# Altium schematic sheet RADC-Power-S05-V00.SchDoc: RADC POWER (12V & USB, 12V Protection, 3V3 Out)
size A3; DrawnBy: Jonn Dillon; DocumentNumber: 6; SheetNumber: 6; SheetTotal: 8; Version: 00; Project: QUTMS RADIO COMPUTE; PageSetup: Record=PageOptions|CenterHorizontal=True|CenterVertical=True|PrintScale=0.97|XCorrection=1.00|YCorrection=1.00|PrintKind=0|BorderSize=5000000|LeftOffset=0|BottomOffset=0|Orientation=2|PaperLength=1000|PaperWidth=1000|Scale=100|PaperSource=7|PrintQuality=-4|MediaType=1|DitherType=10|PaperKind=A4|PrintScaleMode=1
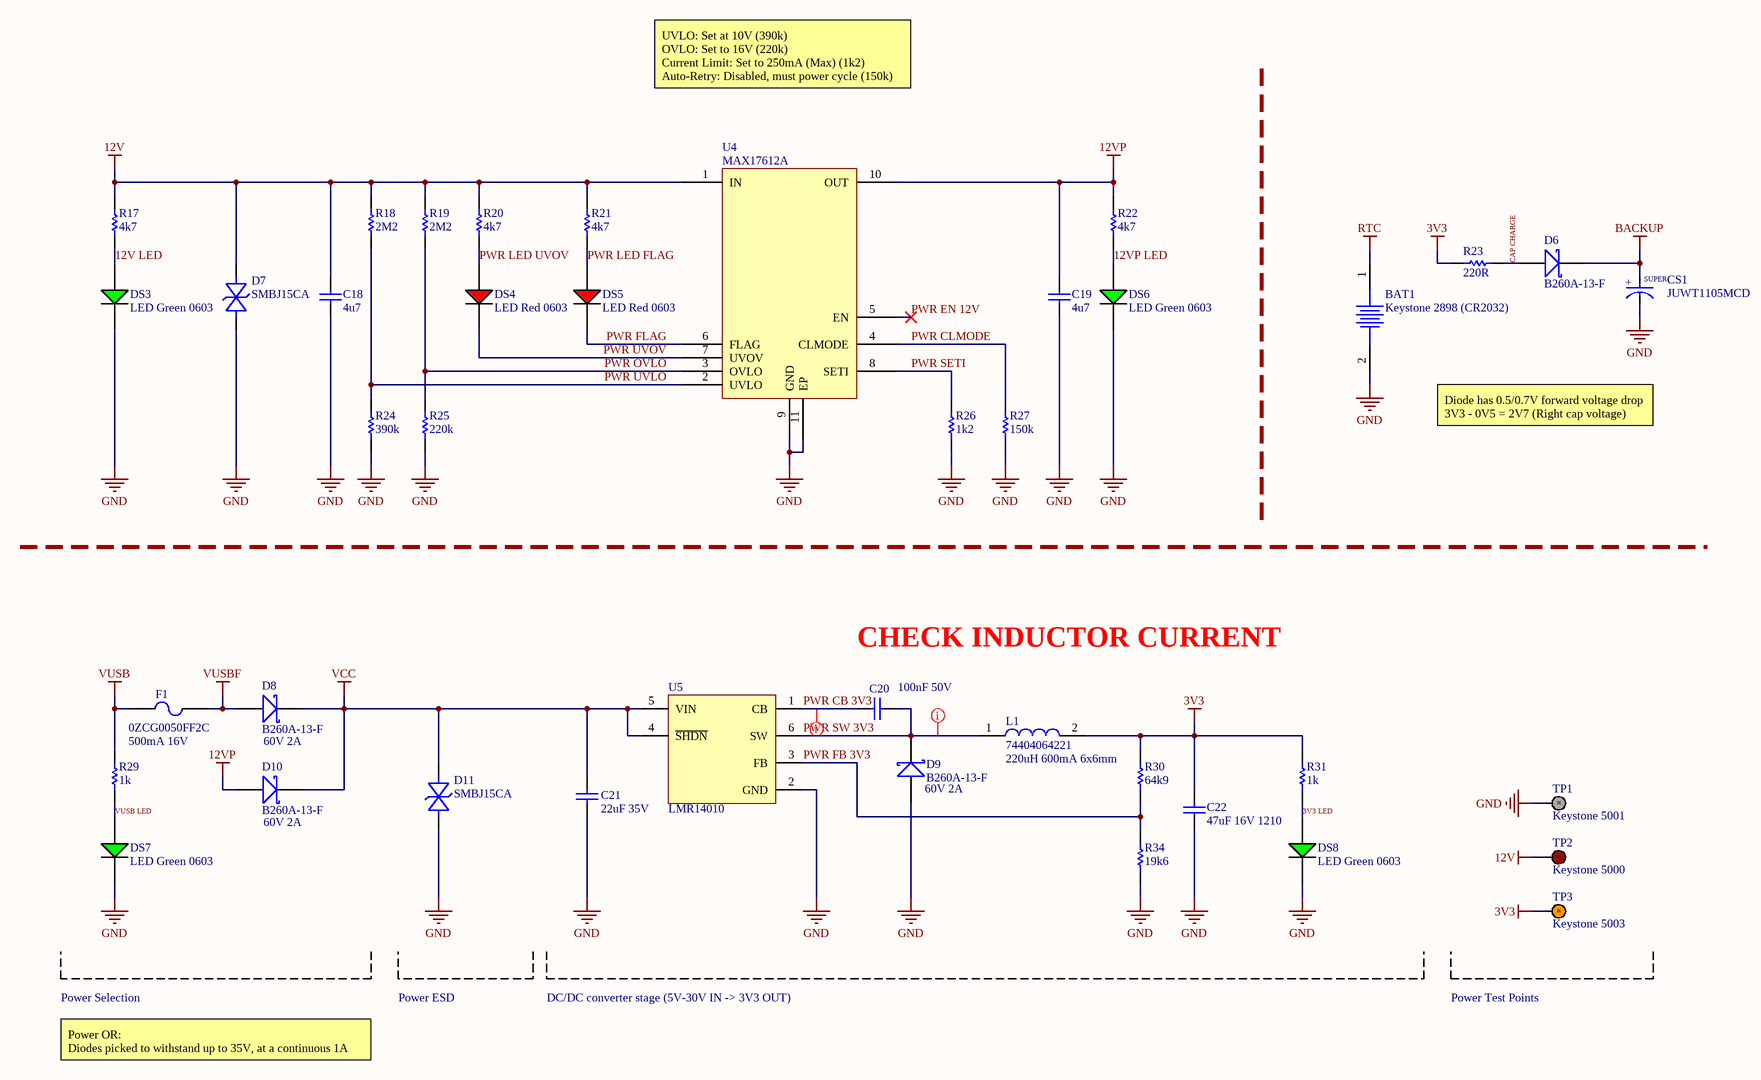
[diagram p0: RADC-Power-S05-V00.SchDoc]

## Parts
BAT1  Keystone 2898 (CR2032)  [Keystone 2898]
C18  4u7  [Cap_Ceramic_0603]
C19  4u7  [Cap_Ceramic_0603]
C20  100nF 50V  [Cap_Ceramic_0603]
C21  22uF 35V  [Cap_Ceramic_1206]
C22  47uF 16V 1210  [Cap_Ceramic_1210]
CS1  JUWT1105MCD  [CAP_ALU_6.3mmD_9mmL]
D6  B260A-13-F  [SMA]
D7  SMBJ15CA  [SMB]
D8  B260A-13-F  [SMA]
D9  B260A-13-F  [SMA]
D10  B260A-13-F  [SMA]
D11  SMBJ15CA  [SMB]
DS3  LED Green 0603  [LED GREEN 0603]
DS4  LED Red 0603  [LED RED 0603]
DS5  LED Red 0603  [LED RED 0603]
DS6  LED Green 0603  [LED GREEN 0603]
DS7  LED Green 0603  [LED GREEN 0603]
DS8  LED Green 0603  [LED GREEN 0603]
F1  0ZCG0050FF2C  [1812 FUSE]
L1  74404064221  [Inductor_6x6mm]
R17  4k7  [Res_ThinFilm_0603]
R18  2M2  [Res_ThinFilm_0603]
R19  2M2  [Res_ThinFilm_0603]
R20  4k7  [Res_ThinFilm_0603]
R21  4k7  [Res_ThinFilm_0603]
R22  4k7  [Res_ThinFilm_0603]
R23  220R  [Res_ThinFilm_0603]
R24  390k  [Res_ThinFilm_0603]
R25  220k  [Res_ThinFilm_0603]
R26  1k2  [Res_ThinFilm_0603]
R27  150k  [Res_ThinFilm_0603]
R29  1k  [Res_ThinFilm_0603]
R30  64k9  [Res_ThinFilm_0603]
R31  1k  [Res_ThinFilm_0603]
R34  19k6  [Res_ThinFilm_0603]
TP1  Keystone 5001  [TestPointHoop_BLACK]
TP2  Keystone 5000  [TestPointHoop_RED]
TP3  Keystone 5003  [TestPointHoop_ORANGE]
U4  MAX17612A  [10-Pin TDFN EP]
U5  LMR14010  [LMR14010]

## Nets
3V3: C22.2 L1.2 R23.1 R30.2 R31.2 TP3.1
12V: C18.2 D7.A(Anode) R17.2 R18.2 R19.2 R20.2 R21.2 TP2.1 U4.1(IN)
12VP: C19.2 D10.A R22.2 U4.10(OUT)
BACKUP: CS1.A D6.K
GND: BAT1.2 C18.1 C19.1 C21.1 C22.1 CS1.K D7.K(Cathode) D9.A D11.K(Cathode) DS3.2(C) DS6.2(C) DS7.2(C) DS8.2(C) R24.1 R25.1 R26.1 R27.1 R34.1 TP1.1 U4.9(GND) U4.11(EP) U5.2(GND)
RTC: BAT1.1
VCC: C21.2 D8.K D10.K D11.A(Anode) U5.4(~{SHDN}) U5.5(VIN)
VUSB: F1.1 R29.2
VUSBF: D8.A F1.2
3V3 LED: DS8.1(A) R31.1
12V LED: DS3.1(A) R17.1
12VP LED: DS6.1(A) R22.1
CAP CHARGE: D6.A R23.2
PWR CB 3V3: C20.1 U5.1(CB)
PWR CLMODE: R27.2 U4.4(CLMODE)
PWR EN 12V: U4.5(EN)
PWR FB 3V3: R30.1 R34.2 U5.3(FB)
PWR FLAG: DS5.2(C) U4.6(FLAG)
PWR LED FLAG: DS5.1(A) R21.1
PWR LED UVOV: DS4.1(A) R20.1
PWR OVLO: R19.1 R25.2 U4.3(OVLO)
PWR SETI: R26.2 U4.8(SETI)
PWR SW 3V3: C20.2 D9.K L1.1 U5.6(SW)
PWR UVLO: R18.1 R24.2 U4.2(UVLO)
PWR UVOV: DS4.2(C) U4.7(UVOV)
VUSB LED: DS7.1(A) R29.1

## Layout directives
net class PWESUPPLY: PWR CB 3V3, PWR SW 3V3

## Notes on the sheet
- UVLO: Set at 10V (390k)
  OVLO: Set to 16V (220k)
  Current Limit: Set to 250mA (Max) (1k2)
  Auto-Retry: Disabled, must power cycle (150k)
- Diode has 0.5/0.7V forward voltage drop
  3V3 - 0V5 = 2V7 (Right cap voltage)
- CHECK INDUCTOR CURRENT
- 500mA 16V
- 60V 2A
- (near D9) 60V 2A
- (near L1) 220uH 600mA 6x6mm
- (near D10) 60V 2A
- Power Selection
- Power OR:
  Diodes picked to withstand up to 35V, at a continuous 1A
- Power ESD
- DC/DC converter stage (5V-30V IN -> 3V3 OUT)
- Power Test Points
- Revision History:
- Sheet Title:
- Rev
- Date
- Description
- Project:
- Size:
- Drawn By:
- A3
- Number:
- Revision:
- Sheet
- Version:
- of
- QUT Motorsport
- O-120, Gardens Point
- 2 George Street
- Brisbane, QLD 4000
- Australia
- Print Date:
- Print Time:
- File Name:
- (in symbol JUWT1105MCD) +; SUPER
- (in symbol TestPoint_Hoop_Black) H
- (in symbol TestPoint_Hoop_Orange) H
- (in symbol TestPoint_Hoop_Red) H

## Library data of the parts
BAT1 = Keystone 2898: Battery Retainer Coin, 20.0mm 1 Cell SMD (SMT) Tab
C18 C19 = 4u7 50V 5% X7R 0603: Capacitor, Ceramic, SMD, 4u7, 50V, 5%, X7R, 0603
C20 = 100nF 50V 5% X7R 0603: Capacitor, Ceramic, SMD, 100nF, 50V, 5%, X7R, 0603
C21 = 22uF 35V 20% X5R 1206: 22µF ±20% 35V Ceramic Capacitor X5R 1206 (3216 Metric); ComponentLink1Description: Digikey; ComponentLink1URL: https://www.digikey.com.au/product-detail/en/tdk-corporation/C3216X5R1V226M160AC/445-8045-1-ND/2792165; ComponentLink2Description: Datasheet; ComponentLink2URL: https://product.tdk.com/info/en/catalog/datasheets/mlcc_commercial_general_en.pdf
C22 = 47uF 16V 10% X7R 1210: Capacitor, Ceramic, SMD, 47uF, 16V, 5%, X7R, 1210
CS1 = JUWT1105MCD: 1F (EDLC) Supercapacitor 2.7V Radial, Can 4Ohm @ 1kHz 1000 Hrs @ 70°C
D6 D8-D10 = B260A-13-F: Diode, Schottky Barrier Rectifier, 60 V, 2 A, B260A-13-F
D7 D11 = SMBJ15CA: Diode, SMD, TVS Diode, 15V 24.4V, DO214AA/SMB; ComponentLink1Description: Digikey; ComponentLink1URL: https://www.digikey.com.au/product-detail/en/littelfuse-inc/SMBJ15CA/SMBJ15CALFCT-ND/285983; ComponentLink2Description: Datasheet; ComponentLink2URL: https://www.littelfuse.com/~/media/electronics/datasheets/tvs_diodes/littelfuse_tvs_diode_smbj_datasheet.pdf.pdf
F1 = 0ZCG0050FF2C: Polymeric PTC Resettable Fuse 16V 500mA Ih Surface Mount 1812 (4532 Metric), Concave
L1 = 74404064221: FIXED IND 220UH 660MA 850 MOHM; ComponentLink1Description: Digikey; ComponentLink1URL: https://www.digikey.com.au/product-detail/en/w%C3%BCrth-elektronik/74404064221/732-7261-1-ND/5353241; ComponentLink2Description: LCSC A; ComponentLink2URL: https://lcsc.com/product-detail/Power-Inductors_Sunlord-SWPA6045S221MT_C91047.html; ComponentLink3Description: LCSC B; ComponentLink3URL: https://lcsc.com/product-detail/Power-Inductors_SXN-Shun-Xiang-Nuo-Elec-SMNR6045-221MT_C467145.html
R17 R20-R22 = 4k7 5% 0603: Resistor, SMD, 4k7, 0.1W, 5%, 0603
R18 R19 = 2M2 5% 0603: Resistor, SMD, 2M2, 0.1W, 5%, 0603
R23 = 220R 5% 0603: Resistor, SMD, 220R, 0.1W, 5%, 0603
R24 = 390k 5% 0603: Resistor, SMD, 390k, 0.1W, 5%, 0603
R25 = 220k 5% 0603: Resistor, SMD, 220k, 0.1W, 5%, 0603
R26 = 1k2 5% 0603: Resistor, SMD, 1k2, 0.1W, 5%, 0603
R27 = 150k 5%, 0603: Resistor, SMD, 150k, 0.1W, 5%, 0603
R29 R31 = 1k 5% 0603: Resistor, SMD, 1k, 0.1W, 5%, 0603
R30 = 64k9 1% 0603: Resistor, SMD, 64k9, 0.1W, 5%, 0603
R34 = 19k6 1% 0603: Resistor, SMD, 19k6, 0.1W, 5%, 0603
TP1 = TestPoint_Hoop_Black
TP2 = TestPoint_Hoop_Red
TP3 = TestPoint_Hoop_Orange
U4 = MAX17612A: Overvoltage, Undervoltage Protection PMIC 10-TDFN-EP (3x3)